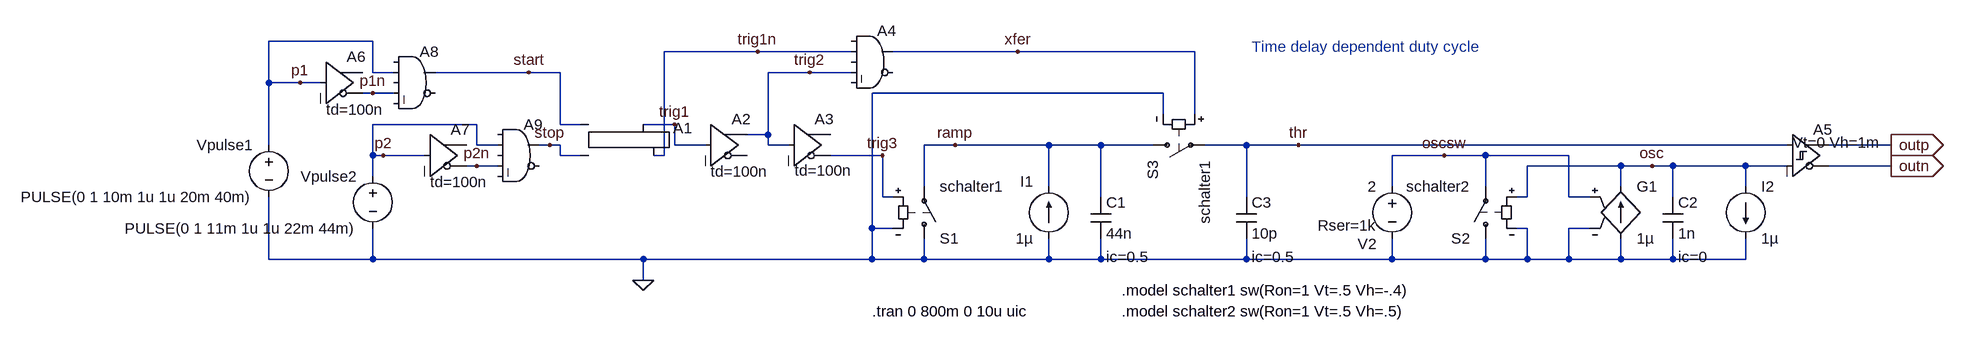
[diagram p0: schematic DelayDependentDutyCycle.asc]
DelayDependentDutyCycle.asc, the LTspice schematic file:
Version 4
SHEET 1 1600 680
WIRE -848 -32 -1008 -32
WIRE -256 -16 -400 -16
WIRE -112 -16 -256 -16
WIRE 144 -16 -48 -16
WIRE 416 -16 144 -16
WIRE -848 16 -848 -32
WIRE -816 16 -848 16
WIRE -608 16 -752 16
WIRE -560 16 -608 16
WIRE -176 16 -240 16
WIRE -112 16 -176 16
WIRE -1008 32 -1008 -32
WIRE -960 32 -1008 32
WIRE -928 32 -960 32
WIRE -848 48 -864 48
WIRE -816 48 -848 48
WIRE 368 48 -80 48
WIRE 368 80 368 48
WIRE 416 80 416 -16
WIRE -688 96 -848 96
WIRE -560 96 -560 16
WIRE -528 96 -560 96
WIRE -384 96 -432 96
WIRE -240 112 -240 16
WIRE -240 112 -272 112
WIRE -1008 128 -1008 32
WIRE -688 128 -688 96
WIRE -656 128 -688 128
WIRE -576 128 -592 128
WIRE -560 128 -576 128
WIRE -384 128 -384 96
WIRE -336 128 -384 128
WIRE -240 128 -240 112
WIRE -208 128 -240 128
WIRE 48 128 0 128
WIRE 192 128 48 128
WIRE 272 128 192 128
WIRE 352 128 272 128
WIRE 496 128 432 128
WIRE 576 128 496 128
WIRE 1328 128 576 128
WIRE 1488 128 1392 128
WIRE -848 144 -848 96
WIRE -832 144 -848 144
WIRE -768 144 -832 144
WIRE -560 144 -560 128
WIRE -528 144 -560 144
WIRE -400 144 -400 -16
WIRE -400 144 -416 144
WIRE -64 144 -144 144
WIRE 800 144 720 144
WIRE 864 144 800 144
WIRE 992 144 864 144
WIRE -688 160 -704 160
WIRE -656 160 -688 160
WIRE 1072 160 928 160
WIRE 1120 160 1072 160
WIRE 1152 160 1120 160
WIRE 1264 160 1152 160
WIRE 1328 160 1264 160
WIRE 1488 160 1392 160
WIRE -848 176 -848 144
WIRE 0 192 0 128
WIRE 192 192 192 128
WIRE 720 192 720 144
WIRE 864 192 864 144
WIRE 1072 192 1072 160
WIRE 1264 192 1264 160
WIRE -64 208 -64 144
WIRE -48 208 -64 208
WIRE 272 208 272 128
WIRE 496 208 496 128
WIRE 928 208 928 160
WIRE 928 208 912 208
WIRE 992 208 992 144
WIRE 1024 208 992 208
WIRE 1152 208 1152 160
WIRE -80 256 -80 48
WIRE -48 256 -80 256
WIRE 928 256 912 256
WIRE 1024 256 992 256
WIRE -1008 304 -1008 208
WIRE -848 304 -848 256
WIRE -848 304 -1008 304
WIRE -432 304 -848 304
WIRE -80 304 -80 256
WIRE -80 304 -432 304
WIRE 0 304 0 272
WIRE 0 304 -80 304
WIRE 192 304 192 272
WIRE 192 304 0 304
WIRE 272 304 272 272
WIRE 272 304 192 304
WIRE 496 304 496 272
WIRE 496 304 272 304
WIRE 720 304 720 272
WIRE 720 304 496 304
WIRE 864 304 864 272
WIRE 864 304 720 304
WIRE 928 304 928 256
WIRE 928 304 864 304
WIRE 992 304 992 256
WIRE 992 304 928 304
WIRE 1072 304 1072 272
WIRE 1072 304 992 304
WIRE 1152 304 1152 272
WIRE 1152 304 1072 304
WIRE 1264 304 1264 272
WIRE 1264 304 1152 304
WIRE -432 336 -432 304
FLAG -432 336 0
FLAG -960 32 p1
FLAG -832 144 p2
FLAG 1120 160 osc
FLAG 800 144 oscsw
FLAG 48 128 ramp
FLAG 576 128 thr
FLAG -64 144 trig3
FLAG 144 -16 xfer
FLAG 1488 160 outn
IOPIN 1488 160 Out
FLAG 1488 128 outp
IOPIN 1488 128 Out
FLAG -384 96 trig1
FLAG -256 -16 trig1n
FLAG -176 16 trig2
FLAG -608 16 start
FLAG -576 128 stop
FLAG -848 48 p1n
FLAG -688 160 p2n
SYMBOL voltage -1008 112 M0
WINDOW 123 0 0 Left 0
WINDOW 39 0 0 Left 0
SYMATTR InstName Vpulse1
SYMATTR Value PULSE(0 1 10m 1u 1u 20m 40m)
SYMBOL voltage 720 176 M0
WINDOW 0 24 104 Left 0
WINDOW 3 24 16 Left 0
WINDOW 123 0 0 Left 0
WINDOW 39 24 76 Left 0
SYMATTR InstName V2
SYMATTR Value 2
SYMATTR SpiceLine Rser=1k
SYMBOL cap 256 208 R0
WINDOW 39 24 92 Left 0
SYMATTR SpiceLine ic=0.5
SYMATTR InstName C1
SYMATTR Value 44n
SYMBOL cap 1136 208 R0
WINDOW 39 24 92 Left 0
SYMATTR SpiceLine ic=0
SYMATTR InstName C2
SYMATTR Value 1n
SYMBOL sw 0 288 M180
SYMATTR InstName S1
SYMATTR Value schalter1
SYMBOL current 192 272 R180
WINDOW 0 24 88 Left 0
WINDOW 3 24 0 Left 0
SYMATTR InstName I1
SYMATTR Value 1µ
SYMBOL sw 864 288 R180
SYMATTR InstName S2
SYMATTR Value schalter2
SYMBOL g 1072 176 R0
SYMATTR InstName G1
SYMATTR Value 1µ
SYMBOL current 1264 192 R0
SYMATTR InstName I2
SYMATTR Value 1µ
SYMBOL voltage -848 160 M0
WINDOW 123 0 0 Left 0
WINDOW 39 0 0 Left 0
SYMATTR InstName Vpulse2
SYMATTR Value PULSE(0 1 11m 1u 1u 22m 44m)
SYMBOL cap 480 208 R0
WINDOW 39 24 92 Left 0
SYMATTR SpiceLine ic=0.5
SYMATTR InstName C3
SYMATTR Value 10p
SYMBOL sw 336 128 M90
SYMATTR InstName S3
SYMATTR Value schalter1
SYMBOL Digital\\buf -336 64 R0
WINDOW 3 8 105 Left 0
SYMATTR Value td=100n
SYMATTR InstName A2
SYMBOL Digital\\buf -208 64 R0
WINDOW 3 9 103 Left 0
SYMATTR Value td=100n
SYMATTR InstName A3
SYMBOL Digital\\and -80 -64 R0
SYMATTR InstName A4
SYMBOL Digital\\diffschmitt 1328 80 R0
WINDOW 3 8 44 Left 0
SYMATTR Value Vt=0 Vh=1m
SYMATTR InstName A5
SYMBOL Digital\\srflop -480 48 R0
SYMATTR InstName A1
SYMBOL Digital\\buf -928 -32 R0
WINDOW 3 8 105 Left 0
SYMATTR Value td=100n
SYMATTR InstName A6
SYMBOL Digital\\buf -768 80 R0
WINDOW 3 8 105 Left 0
SYMATTR Value td=100n
SYMATTR InstName A7
SYMBOL Digital\\and -784 -32 R0
SYMATTR InstName A8
SYMBOL Digital\\and -624 80 R0
SYMATTR InstName A9
TEXT 304 384 Left 0 !.model schalter2 sw(Ron=1 Vt=.5 Vh=.5)
TEXT 304 352 Left 0 !.model schalter1 sw(Ron=1 Vt=.5 Vh=-.4)
TEXT -80 384 Left 0 !.tran 0 800m 0 10u uic
TEXT 504 -24 Left 0 ;Time delay dependent duty cycle

The netlist it stands for:
* DelayDependentDutyCycle.asc
Vpulse1 p1 0 PULSE(0 1 10m 1u 1u 20m 40m)
V2 oscsw 0 2 Rser=1k
C1 ramp 0 44n ic=0.5
C2 osc 0 1n ic=0
S1 0 ramp trig3 0 schalter1
I1 0 ramp 1µ
S2 0 oscsw osc 0 schalter2
G1 0 osc oscsw 0 1µ
I2 osc 0 1µ
Vpulse2 p2 0 PULSE(0 1 11m 1u 1u 22m 44m)
C3 thr 0 10p ic=0.5
S3 ramp thr xfer 0 schalter1
A2 trig1 0 0 0 0 0 trig2 0 BUF td=100n
A3 trig2 0 0 0 0 trig3 0 0 BUF td=100n
A4 0 trig1n 0 trig2 0 0 xfer 0 AND
A5 thr osc 0 0 0 outn outp 0 SCHMITT Vt=0 Vh=1m
A1 start stop 0 0 0 trig1n trig1 0 SRFLOP
A6 p1 0 0 0 0 p1n 0 0 BUF td=100n
A7 p2 0 0 0 0 p2n 0 0 BUF td=100n
A8 0 p1 0 p1n 0 0 start 0 AND
A9 0 p2 0 p2n 0 0 stop 0 AND
.model schalter2 sw(Ron=1 Vt=.5 Vh=.5)
.model schalter1 sw(Ron=1 Vt=.5 Vh=-.4)
.tran 0 800m 0 10u uic
* Time delay dependent duty cycle
.backanno
.end